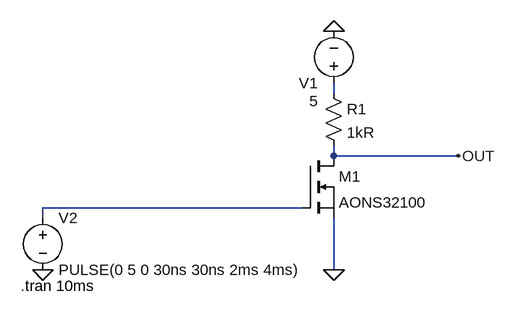
[diagram p0: schematic NOT_gate.asc]
NOT_gate.asc, the LTspice schematic file:
Version 4
SHEET 1 880 680
WIRE 224 192 224 176
WIRE 224 288 224 272
WIRE 416 288 224 288
WIRE 176 368 -224 368
WIRE -224 384 -224 368
WIRE 224 464 224 384
FLAG -224 464 0
FLAG 224 96 0
FLAG 224 464 0
FLAG 416 288 OUT
SYMBOL voltage 224 192 R180
WINDOW 3 24 -12 Left 2
WINDOW 123 0 0 Left 0
WINDOW 39 0 0 Left 0
SYMATTR InstName V1
SYMATTR Value 5
SYMBOL voltage -224 368 R0
WINDOW 123 0 0 Left 0
WINDOW 39 0 0 Left 0
SYMATTR InstName V2
SYMATTR Value PULSE(0 5 0 30ns 30ns 2ms 4ms)
SYMBOL res 208 176 R0
SYMATTR InstName R1
SYMATTR Value 1kR
SYMBOL nmos 176 288 R0
SYMATTR InstName M1
SYMATTR Value AONS32100
TEXT -258 488 Left 2 !.tran 10ms

The netlist it stands for:
* NOT_gate.asc
V1 N001 0 5
V2 N002 0 PULSE(0 5 0 30ns 30ns 2ms 4ms)
R1 N001 OUT 1kR
M1 OUT N002 0 0 AONS32100
.model NMOS NMOS
.model PMOS PMOS
.lib standard.mos
.tran 10ms
.backanno
.end